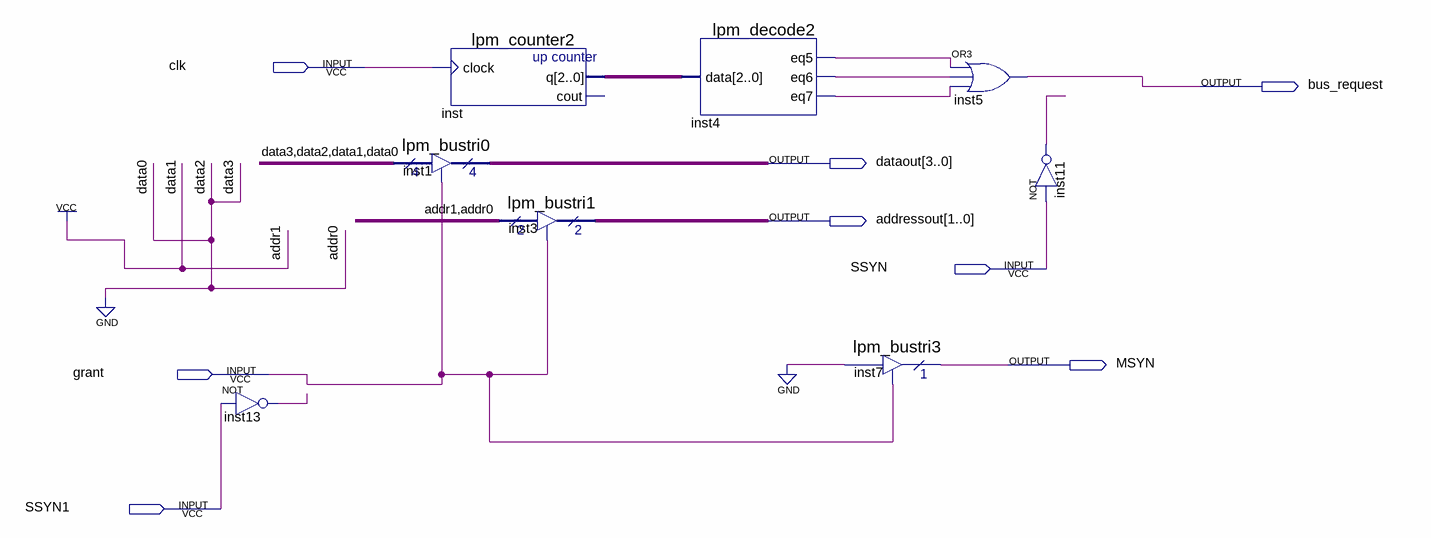
[diagram p0: schematic sheet]
// Quartus schematic master2.bdf as structural Verilog: 8 symbols, 8 pins
module master2 (
  input  clk,
  input  SSYN,
  input  grant,
  input  SSYN1,
  output bus_request,
  output [3:0] dataout,
  output [1:0] addressout,
  output MSYN
);

  wire inst4_eq5, inst4_eq6, inst4_eq7, inst11_out, inst13_out;
  wire [2:0] inst_q;

  not inst13 (inst13_out, SSYN1);
  lpm_counter2 inst (.clock(clk), .q(inst_q));  // open: cout
  lpm_bustri0 inst1 (.enabledt(grant), .data(4'b0010), .tridata(dataout));
  lpm_bustri1 inst3 (.enabledt(grant), .data(2'b10), .tridata(addressout));
  lpm_decode2 inst4 (.data(inst_q), .eq5(inst4_eq5), .eq6(inst4_eq6), .eq7(inst4_eq7));
  lpm_bustri3 inst7 (.enabledt(grant), .data(1'b0), .tridata(MSYN));
  or inst5 (bus_request, inst4_eq5, inst4_eq6, inst4_eq7);
  not inst11 (inst11_out, SSYN);
endmodule
